# Altium schematic sheet CAN.SchDoc
size A4; DocumentNumber: 6; SheetNumber: 6; SheetTotal: 8
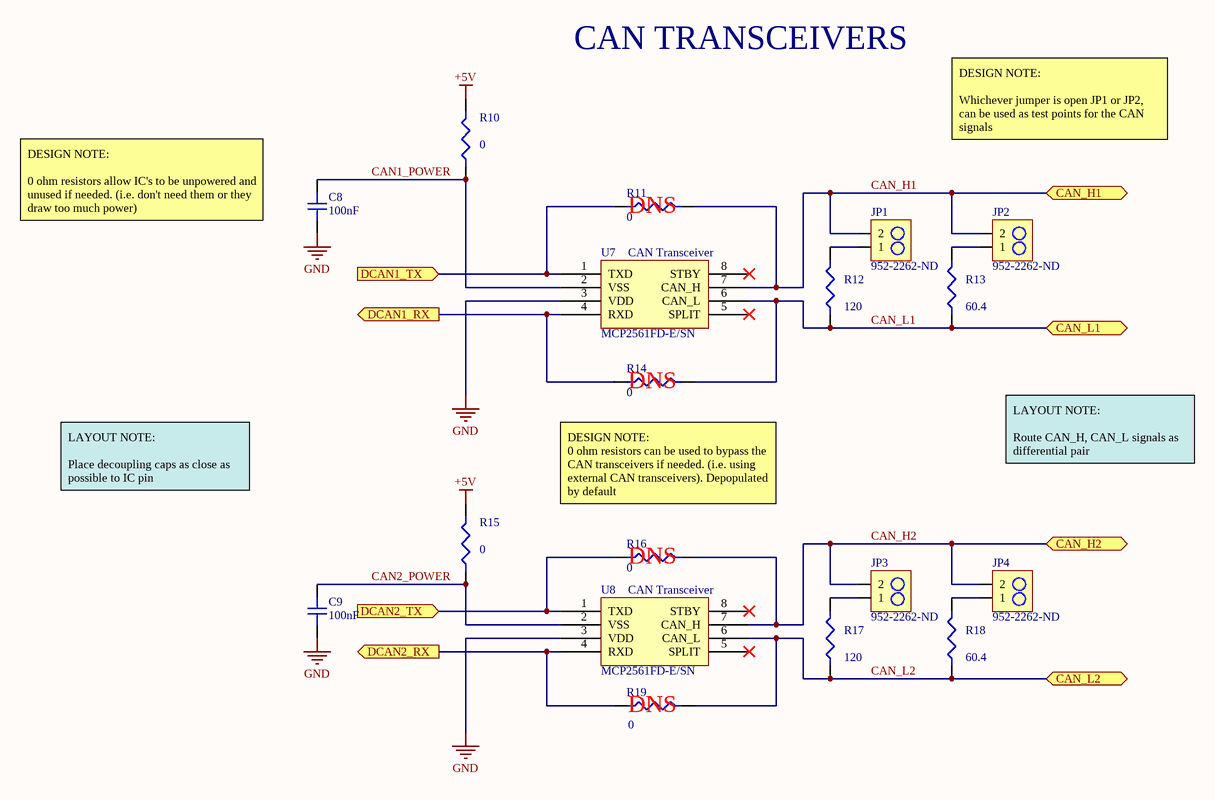
[diagram p0: CAN.SchDoc]

## Parts
C8  100nF  [C0805]
C9  100nF  [C0805]
JP1  952-2262-ND  [2PIN_HEADER]
JP2  952-2262-ND  [2PIN_HEADER]
JP3  952-2262-ND  [2PIN_HEADER]
JP4  952-2262-ND  [2PIN_HEADER]
R10  0  [R0805]
R11  0  [R0805]
R12  120  [R0805]
R13  60.4  [R0805]
R14  0  [R0805]
R15  0  [R0805]
R16  0  [R0805]
R17  120  [R0805]
R18  60.4  [R0805]
R19  0  [R0805]
U7  MCP2561FD-E/SN  [8-SOIC_MCP2561]
U8  MCP2561FD-E/SN  [8-SOIC_MCP2561]

## Ports
CAN_H1, CAN_H2, CAN_L1, CAN_L2, DCAN1_RX, DCAN1_TX, DCAN2_RX, DCAN2_TX

## Nets
+5V: R10.2 R15.2
GND: C8.1 C9.1 U7.3(VDD) U8.3(VDD)
CAN1_POWER: C8.2 R10.1 U7.2(VSS)
CAN2_POWER: C9.2 R15.1 U8.2(VSS)
CAN_H1: JP1.2 JP2.2 R11.2 U7.7(CAN_H) ; port CAN_H1
CAN_H2: JP3.2 JP4.2 R16.2 U8.7(CAN_H) ; port CAN_H2
CAN_L1: R12.1 R13.1 R14.2 U7.6(CAN_L) ; port CAN_L1
CAN_L2: R17.1 R18.1 R19.2 U8.6(CAN_L) ; port CAN_L2
DCAN1_RX: R14.1 U7.4(RXD) ; port DCAN1_RX
DCAN1_TX: R11.1 U7.1(TXD) ; port DCAN1_TX
DCAN2_RX: R19.1 U8.4(RXD) ; port DCAN2_RX
DCAN2_TX: R16.1 U8.1(TXD) ; port DCAN2_TX
NetJP1_1: JP1.1 R12.2
NetJP2_1: JP2.1 R13.2
NetJP3_1: JP3.1 R17.2
NetJP4_1: JP4.1 R18.2

Not connected (* = marked no-connect by the designer): U7 5(SPLIT)* 8(STBY)*; U8 5(SPLIT)* 8(STBY)*

## Notes on the sheet
- CAN TRANSCEIVERS
- DESIGN NOTE:
  Whichever jumper is open JP1 or JP2, can be used as test points for the CAN signals
- DESIGN NOTE:
  0 ohm resistors allow IC's to be unpowered and unused if needed. (i.e. don't need them or they draw too much power)
- (near R11) DNS
- (near U7) CAN Transceiver
- (near R14) DNS
- LAYOUT NOTE:
  Place decoupling caps as close as possible to IC pin
- LAYOUT NOTE:
  Route CAN_H, CAN_L signals as differential pair
- DESIGN NOTE:
  0 ohm resistors can be used to bypass the CAN transceivers if needed. (i.e. using external CAN transceivers). Depopulated by default
- (near U8) CAN Transceiver
- (near R16) DNS
- (near R19) DNS

## Library data of the parts
C8 C9 = GRM21B7U1A104JA01L: CAP MLCC 100nF 10Volts U2J 5%; Manufacturer: Murata; Voltage Rating: 10V; Supplier 1: Digi-Key; Manufacturer Part Number: GRM21B7U1A104JA01L; Stock 1: 6000; Pricing 1: 1=0.46, 10=0.32, 100=0.192, 500=0.144, 1000=0.1216 (USD); Mount: Surface Mount; Case/Package: 0805; Case Code (Imperial): 0805; Case Code (Metric): 2012; Min Operating Temperature: -55°C; Max Operating Temperature: 125°C; Capacitance: 100nF; Voltage Rating (DC): 10V; Tolerance: 5%; Packaging: Tape and Reel; Package Quantity: 3000; Dielectric: U2J; Termination: SMD/SMT; Length: 2mm; Height: 1.25mm; Width: 0.049inch; Thickness: 0.053inch; Depth: 1.25mm; Radiation Hardening: No; ComponentLink1URL: https://datasheet.ciiva.com/5424/product-5424660.pdf; ComponentLink1Description: https://datasheet.ciiva.com/5424/product-5424660.pdf; ComponentLink2URL: https://datasheet.ciiva.com/17451/product-17451845.pdf; ComponentLink2Description: https://datasheet.ciiva.com/17451/product-17451845.pdf; ComponentLink3URL: https://datasheet.ciiva.com/11618/product-11618924.pdf; ComponentLink3Description: https://datasheet.ciiva.com/11618/product-11618924.pdf; Supplier Part Number 1: 490-11592-6-ND
JP1-JP4 = M20-9990246: CONN_HeaderPins2pos Headers & Wire Housings 02 SIL VERTICAL PIN HEADER TIN; Manufacturer: Harwin; Contact Resistance: 30mR; Max Current Rating: 3A; Number of Positions: 2; Gender: Male; Connector Type: Male Pin; Insulation Resistance: 10GR; Voltage Rating (AC): 750V; Pitch: 2.54mm; Supplier 1: Digi-Key; Manufacturer Part Number: M20-9990246; Stock 1: 53577; Pricing 1: 1=0.11, 10=0.099, 100=0.0609, 500=0.0504, 1000=0.0441, 5000=0.0378, 10000=0.0368 (USD); Case/Package: SIL; Colour: Black; Housing Colour: Black; Housing Material: Nylon; Contact Plating: Tin; Contact Material: Bronze,Brass; Min Operating Temperature: -40°C; Max Operating Temperature: 105°C; Package Quantity: 1000; Packaging: Bulk; Termination: Solder; Number of Rows: 1; Number of Contacts: 2; Orientation: Straight; Current Rating: 3A; Length: 5.08mm; Depth: 2.54mm; Contact Mating Length: 0.24inch; Radiation Hardening: No; REACH SVHC: No SVHC; ComponentLink1URL: https://datasheet.ciiva.com/8046/315376-8046930.pdf; ComponentLink1Description: https://datasheet.ciiva.com/8046/315376-8046930.pdf; ComponentLink2URL: https://datasheet.ciiva.com/6833/m20-999-6833368.pdf; ComponentLink2Description: https://datasheet.ciiva.com/6833/m20-999-6833368.pdf; ComponentLink3URL: https://datasheet.ciiva.com/11745/0900766b81034e61-11745755.pdf; ComponentLink3Description: https://datasheet.ciiva.com/11745/0900766b81034e61-11745755.pdf; ComponentLink4URL: https://datasheet.ciiva.com/22660/1830818-22660571.pdf; ComponentLink4Description: https://datasheet.ciiva.com/22660/1830818-22660571.pdf; ComponentLink5URL: https://datasheet.ciiva.com/26852/getdatasheetpartid-384170-26852203.pdf; ComponentLink5Description: https://datasheet.ciiva.com/26852/getdatasheetpartid-384170-26852203.pdf; Supplier Part Number 1: 952-2262-ND
R10 R11 R14-R16 R19 = RC0805JR-070RL: RES SMD 0 OHM 1/8W 0805; Manufacturer: Yageo; Resistance: 0mR; Tolerance: 5%; Voltage Rating: 150V; Power Rating: 125mW; Temperature Coefficient: 200ppm/°C; Supplier 1: Digi-Key; Manufacturer Part Number: RC0805JR-070RL; Stock 1: 5922085; Pricing 1: 1=0.1, 10=0.018, 25=0.0128, 50=0.0096, 100=0.0071, 250=0.0054, 500=0.0044, 1000=0.0032 (USD); Case/Package: 0805; Number of Pins: 2; Case Code (Imperial): 0805; Case Code (Metric): 2012; Contact Plating: Tin,Matte; Min Operating Temperature: -55°C; Max Operating Temperature: 155°C; Packaging: Tape and Reel; Voltage Rating (DC): 150V; Termination: SMD/SMT; Composition: Thick Film; Military Standard: Not; Length: 2mm; Height: 0.5mm; Width: 1.25mm; Depth: 1.25mm; Radiation Hardening: No; REACH SVHC: Unknown; Lead Free: Lead Free; ComponentLink1URL: https://datasheet.ciiva.com/7941/1738694-7941861.pdf; ComponentLink1Description: https://datasheet.ciiva.com/7941/1738694-7941861.pdf; ComponentLink2URL: https://datasheet.ciiva.com/7941/1738694-7941862.pdf; ComponentLink2Description: https://datasheet.ciiva.com/7941/1738694-7941862.pdf; ComponentLink3URL: https://datasheet.ciiva.com/11819/0900766b8106beab-11819430.pdf; ComponentLink3Description: https://datasheet.ciiva.com/11819/0900766b8106beab-11819430.pdf; ComponentLink4URL: https://datasheet.ciiva.com/7941/1738694-7941863.pdf; ComponentLink4Description: https://datasheet.ciiva.com/7941/1738694-7941863.pdf; ComponentLink5URL: https://datasheet.ciiva.com/15190/getdatasheetpartid-330685-15190028.pdf; ComponentLink5Description: https://datasheet.ciiva.com/15190/getdatasheetpartid-330685-15190028.pdf; Supplier Part Number 1: 311-0.0ARDKR-ND
R12 R17 = RC0805FR-07120RL: RES SMD 120 OHM 1% 1/8W 0805; Manufacturer: Yageo; Resistance: 120R; Power Rating: 125mW; Voltage Rating: 150V; Temperature Coefficient: 100ppm/°C; Supplier 1: Digi-Key; Manufacturer Part Number: RC0805FR-07120RL; Stock 1: 632664; Pricing 1: 1=0.1, 10=0.022, 100=0.0088, 1000=0.004, 2500=0.0034 (USD); Case/Package: 0805; Case Code (Metric): 2012; Case Code (Imperial): 0805; Min Operating Temperature: -55°C; Max Operating Temperature: 155°C; Tolerance: 1%; Package Quantity: 1; Packaging: Tape and Reel; Composition: Thick Film; Number of Terminations: 2; Termination: SMD/SMT; Military Standard: Not; Max Power Dissipation: 125mW; Length: 2mm; Height: 0.5mm; Width: 0.049inch; Depth: 1.25mm; REACH SVHC: Unknown; Lead Free: Lead Free; ComponentLink1URL: https://datasheet.ciiva.com/2491/pyu-r-int-thick-7-2491585.pdf; ComponentLink1Description: https://datasheet.ciiva.com/2491/pyu-r-int-thick-7-2491585.pdf; ComponentLink2URL: https://datasheet.ciiva.com/2491/pyu-r-int-thick-7-2491586.pdf; ComponentLink2Description: https://datasheet.ciiva.com/2491/pyu-r-int-thick-7-2491586.pdf; ComponentLink3URL: https://datasheet.ciiva.com/2491/pyu-r-int-thick-7-2491587.pdf; ComponentLink3Description: https://datasheet.ciiva.com/2491/pyu-r-int-thick-7-2491587.pdf; ComponentLink4URL: https://datasheet.ciiva.com/12558/rc0805-257173-12558661.pdf; ComponentLink4Description: https://datasheet.ciiva.com/12558/rc0805-257173-12558661.pdf; ComponentLink5URL: https://datasheet.ciiva.com/11819/0900766b8106beab-11819786.pdf; ComponentLink5Description: https://datasheet.ciiva.com/11819/0900766b8106beab-11819786.pdf; ComponentLink6URL: https://datasheet.ciiva.com/7941/444164-7941691.pdf; ComponentLink6Description: https://datasheet.ciiva.com/7941/444164-7941691.pdf; ComponentLink7URL: https://datasheet.ciiva.com/7941/444164-7941692.pdf; ComponentLink7Description: https://datasheet.ciiva.com/7941/444164-7941692.pdf; ComponentLink8URL: https://datasheet.ciiva.com/16964/rc0805-16964606.pdf; ComponentLink8Description: https://datasheet.ciiva.com/16964/rc0805-16964606.pdf; Supplier Part Number 1: 311-120CRCT-ND
R13 R18 = RC0805FR-0760R4L: RES SMD 60.4 OHM 1% 1/8W 0805; Manufacturer: Yageo; Resistance: 60.4R; Power Rating: 125mW; Temperature Coefficient: 100ppm/°C; Voltage Rating (DC): 150V; Supplier 1: Digi-Key; Manufacturer Part Number: RC0805FR-0760R4L; Stock 1: 189238; Pricing 1: 1=0.1, 10=0.022, 100=0.0088, 1000=0.004, 2500=0.0034 (USD); Case/Package: 0805; Case Code (Metric): 2012; Case Code (Imperial): 0805; Contact Plating: Tin,Lead,Matte; Min Operating Temperature: -55°C; Max Operating Temperature: 155°C; Package Quantity: 1; Tolerance: 1%; Packaging: Tape and Reel; Composition: Thick Film; Military Standard: Not; Voltage Rating: 150V; Number of Terminations: 2; Termination: SMD/SMT; Max Power Dissipation: 125mW; Length: 0.079inch; Height: 0.024inch; Width: 0.049inch; Depth: 1.25mm; Radiation Hardening: No; Lead Free: Lead Free; ComponentLink1URL: https://datasheet.ciiva.com/2457/pyu-r-int-thick-7-2457216.pdf; ComponentLink1Description: https://datasheet.ciiva.com/2457/pyu-r-int-thick-7-2457216.pdf; ComponentLink2URL: https://datasheet.ciiva.com/2457/pyu-r-int-thick-7-2457217.pdf; ComponentLink2Description: https://datasheet.ciiva.com/2457/pyu-r-int-thick-7-2457217.pdf; ComponentLink3URL: https://datasheet.ciiva.com/2457/pyu-r-int-thick-7-2457215.pdf; ComponentLink3Description: https://datasheet.ciiva.com/2457/pyu-r-int-thick-7-2457215.pdf; Supplier Part Number 1: 311-60.4CRDKR-ND
U7 U8 = MCP2561FD-E/SN: IC CAN Bus, Transceiver, CAN, 1, 1, 4.5 V, 5.5 V, SOIC; Manufacturer: Microchip; Number of Receivers: 1; Data Rate: 8Mbps; Min Supply Voltage: 4.5V; Max Supply Voltage: 5.5V; Max Supply Current: 70mA; Receiver Hysteresis: 200mV; Supplier 1: Digi-Key; Manufacturer Part Number: MCP2561FD-E/SN; Stock 1: 1072; Pricing 1: 1=0.97, 25=0.8084, 100=0.735 (USD); Case/Package: SOIC; Number of Pins: 8; Weight: 0.019048oz; Min Operating Temperature: -40°C; Max Operating Temperature: 125°C; Packaging: Rail/Tube; Number of Transceivers: 1; Logic Function: Transceiver; Interface: CAN; Number of Drivers: 1; Number of Transmit Buffers: 1; Number of Receive Buffers: 1; Operating Supply Current: 70mA; Package Quantity: 100; Length: 4.9mm; Height: 1.5mm; Width: 3.9mm; REACH SVHC: No SVHC; Lead Free: Lead Free; ComponentLink1URL: https://datasheet.ciiva.com/48512/mcp2561fd-eng-tds-48512069.pdf; ComponentLink1Description: https://datasheet.ciiva.com/48512/mcp2561fd-eng-tds-48512069.pdf; ComponentLink2URL: https://datasheet.ciiva.com/46406/1821190-46406024.pdf; ComponentLink2Description: https://datasheet.ciiva.com/46406/1821190-46406024.pdf; ComponentLink3URL: https://datasheet.ciiva.com/46406/1821190-46406056.pdf; ComponentLink3Description: https://datasheet.ciiva.com/46406/1821190-46406056.pdf; ComponentLink4URL: https://datasheet.ciiva.com/48473/20005284a-48473177.pdf; ComponentLink4Description: https://datasheet.ciiva.com/48473/20005284a-48473177.pdf